# EasyEDA schematic 1-Schematic_No filter booth pcb.json
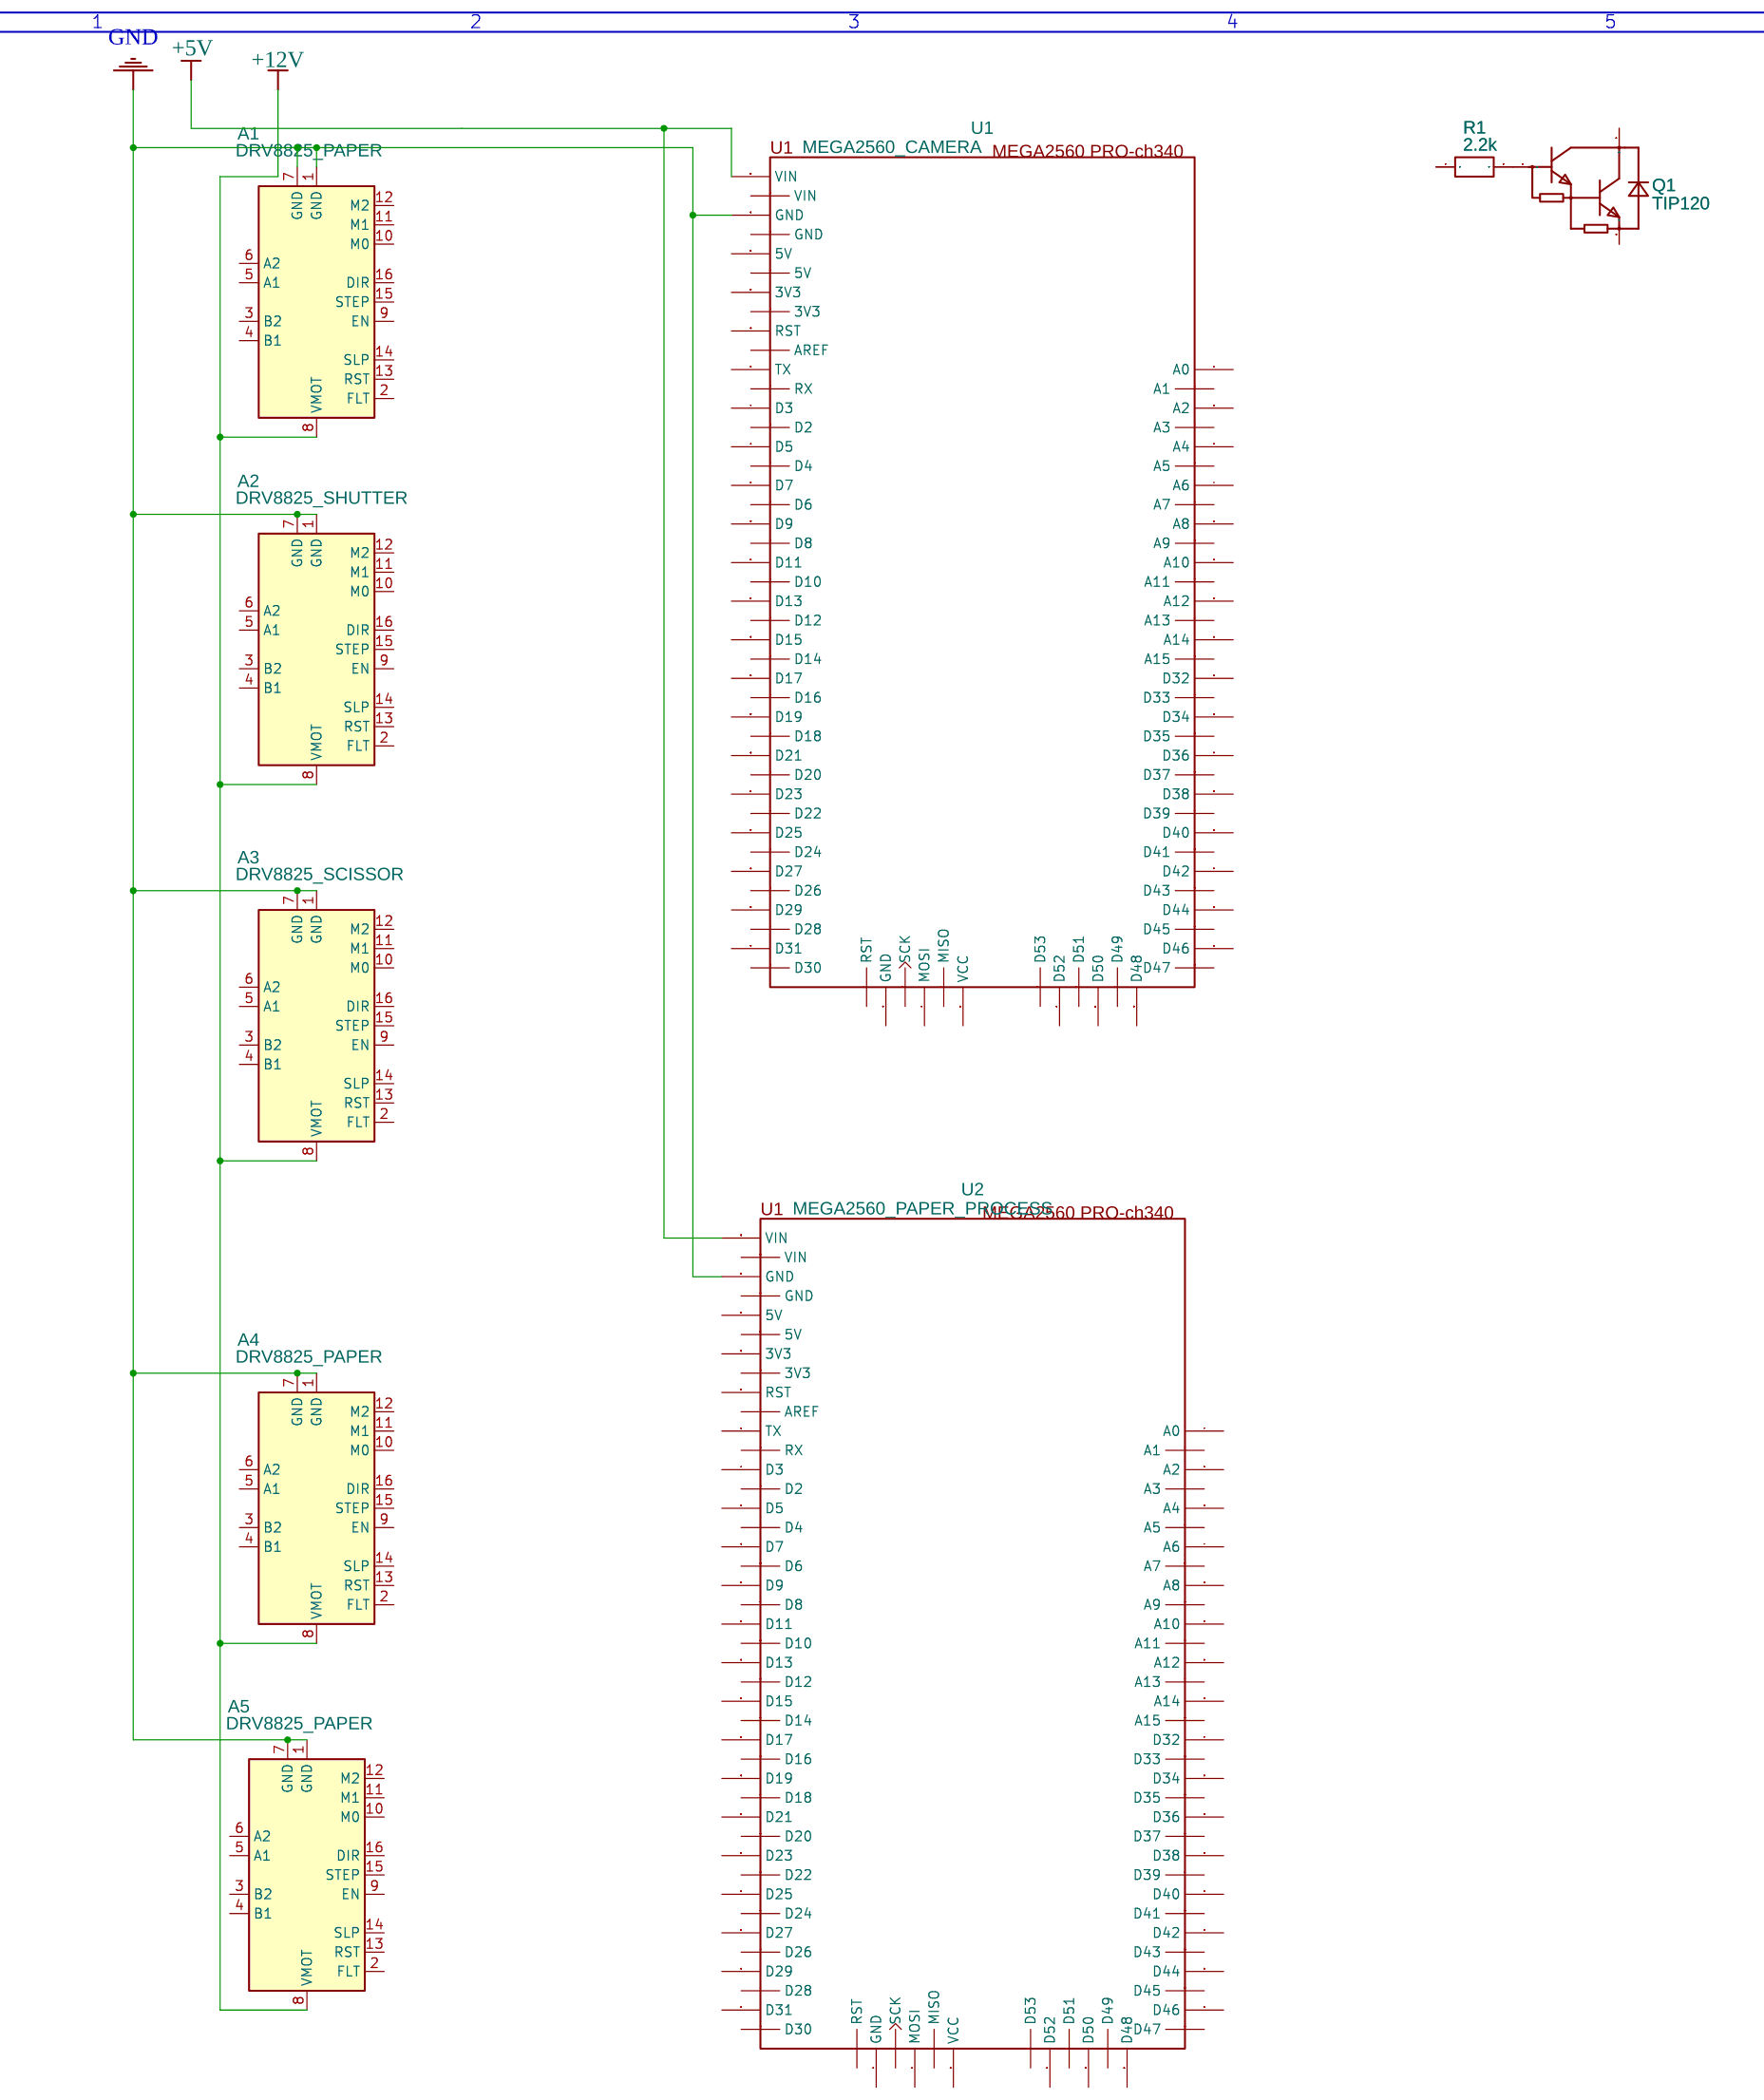
[diagram p0: schematic sheet]

## Parts
A1  DRV8825_PAPER  [POLOLU_BREAKOUT-16_15.2X20.3MM]
A2  DRV8825_SHUTTER  [POLOLU_BREAKOUT-16_15.2X20.3MM]
A3  DRV8825_SCISSOR  [POLOLU_BREAKOUT-16_15.2X20.3MM]
A4  DRV8825_PAPER  [POLOLU_BREAKOUT-16_15.2X20.3MM]
A5  DRV8825_PAPER  [POLOLU_BREAKOUT-16_15.2X20.3MM]
Q1  TIP120  [TO-220-3_L10.0-W4.5-P2.54-L]
R1  2.2k  [1210]
U1  MEGA2560_CAMERA  [MEGA2560 PRO-CH340G]
U2  MEGA2560_PAPER_PROCESS  [MEGA2560 PRO-CH340G]

## Library data of the parts
A1 A4 A5 = Pololu_Breakout_DRV8825: Contributor: KiCAD; license: https://www.gnu.org/licenses/lgpl-2.1.html; Manufacturer: Pololu
A2 A3 = Pololu_Breakout_DRV8825: Contributor: KiCAD; license: https://www.gnu.org/licenses/lgpl-2.1.html
Q1 = TIP120: Supplier: LCSC; Supplier Part: C262990; Manufacturer: STMicroelectronics; Contributor: LCSC
R1 = Res_1210(1/3W)_EU
U1 U2 = MEGA2560 PRO-ch340G: Manufacturer: RobotDyn; Supplier: RobotDyn; link: https://robotdyn.com/mega-2560-pro-embed-ch340g-atmega2560-16au.html; Contributor: brandstetter.sys

## Nets
+5V: U1.86(VIN) U2.86(VIN)
+12V: A1.8(VMOT) A2.8(VMOT) A3.8(VMOT) A4.8(VMOT) A5.8(VMOT)
GND: A1.1(GND) A1.7(GND) A2.1(GND) A2.7(GND) A3.1(GND) A3.7(GND) A4.1(GND) A4.7(GND) A5.1(GND) A5.7(GND) U1.84(GND) U2.84(GND)
Net-(Q1-1): Q1.1(B) R1.2

Not connected (* = marked no-connect by the designer): A1 2(FLT) 3(B2) 4(B1) 5(A1) 6(A2) 9(EN) 10(M0) 11(M1) 12(M2) 13(RST) 14(SLP) 15(STEP) 16(DIR); A2 2(FLT) 3(B2) 4(B1) 5(A1) 6(A2) 9(EN) 10(M0) 11(M1) 12(M2) 13(RST) 14(SLP) 15(STEP) 16(DIR); A3 2(FLT) 3(B2) 4(B1) 5(A1) 6(A2) 9(EN) 10(M0) 11(M1) 12(M2) 13(RST) 14(SLP) 15(STEP) 16(DIR); A4 2(FLT) 3(B2) 4(B1) 5(A1) 6(A2) 9(EN) 10(M0) 11(M1) 12(M2) 13(RST) 14(SLP) 15(STEP) 16(DIR); A5 2(FLT) 3(B2) 4(B1) 5(A1) 6(A2) 9(EN) 10(M0) 11(M1) 12(M2) 13(RST) 14(SLP) 15(STEP) 16(DIR); Q1 2(C) 3(E); R1 1; U1 1(A0) 2(A1) 3(A2) 4(A3) 5(A4) 6(A5) 7(A6) 8(A7) 9(A8) 10(A9) 11(A10) 12(A11) 13(A12) 14(A13) 15(A14) 16(A15) 17(D32) 18(D33) 19(D34) 20(D35) 21(D36) 22(D37) 23(D38) 24(D39) 25(D40) 26(D41) 27(D42) 28(D43) 29(D44) 30(D45) 31(D46) 32(D47) 33(D48) 34(D49) 35(D50) 36(D51) 37(D52) 38(D53) 39(VCC) 40(MISO) 41(MOSI) 42(SCK) 43(GND) 44(RST) 45(D30) 46(D31) 47(D28) 48(D29) 49(D26) 50(D27) 51(D24) 52(D25) 53(D22) 54(D23) 55(D20) 56(D21) 57(D18) 58(D19) 59(D16) 60(D17) 61(D14) 62(D15) 63(D12) 64(D13) 65(D10) 66(D11) 67(D8) 68(D9) 69(D6) 70(D7) 71(D4) 72(D5) 73(D2) 74(D3) 75(RX) 76(TX) 77(AREF) 78(RST) 79(3V3) 80(3V3) 81(5V) 82(5V) 83(GND) 85(VIN); U2 1(A0) 2(A1) 3(A2) 4(A3) 5(A4) 6(A5) 7(A6) 8(A7) 9(A8) 10(A9) 11(A10) 12(A11) 13(A12) 14(A13) 15(A14) 16(A15) 17(D32) 18(D33) 19(D34) 20(D35) 21(D36) 22(D37) 23(D38) 24(D39) 25(D40) 26(D41) 27(D42) 28(D43) 29(D44) 30(D45) 31(D46) 32(D47) 33(D48) 34(D49) 35(D50) 36(D51) 37(D52) 38(D53) 39(VCC) 40(MISO) 41(MOSI) 42(SCK) 43(GND) 44(RST) 45(D30) 46(D31) 47(D28) 48(D29) 49(D26) 50(D27) 51(D24) 52(D25) 53(D22) 54(D23) 55(D20) 56(D21) 57(D18) 58(D19) 59(D16) 60(D17) 61(D14) 62(D15) 63(D12) 64(D13) 65(D10) 66(D11) 67(D8) 68(D9) 69(D6) 70(D7) 71(D4) 72(D5) 73(D2) 74(D3) 75(RX) 76(TX) 77(AREF) 78(RST) 79(3V3) 80(3V3) 81(5V) 82(5V) 83(GND) 85(VIN)

## Notes on the sheet
- 1
- 2
- 3
- 4
- 5
- 6
- 7
- 8
- A
- A
- B
- B
- C
- C
- D
- D
- E
- E
- TITLE:
- No_Filter_Booth
- REV:
- 1.0
- Company:
- Flo Gales
- Sheet:
- 1/1
- Date:
- 2020-01-09
- Drawn By:
- rataflo
- 1
- 2
- 3
- 4
- 5
- 6
- 7
- 8
